# EasyEDA schematic SCH_stm32智能鱼缸v6_2024-12-07.json
TITLE: Sheet_1; REV: 1.0; Date: 2024-01-09; Sheet: 1/1; Drawn By: LightningFlash; Company: Your Company
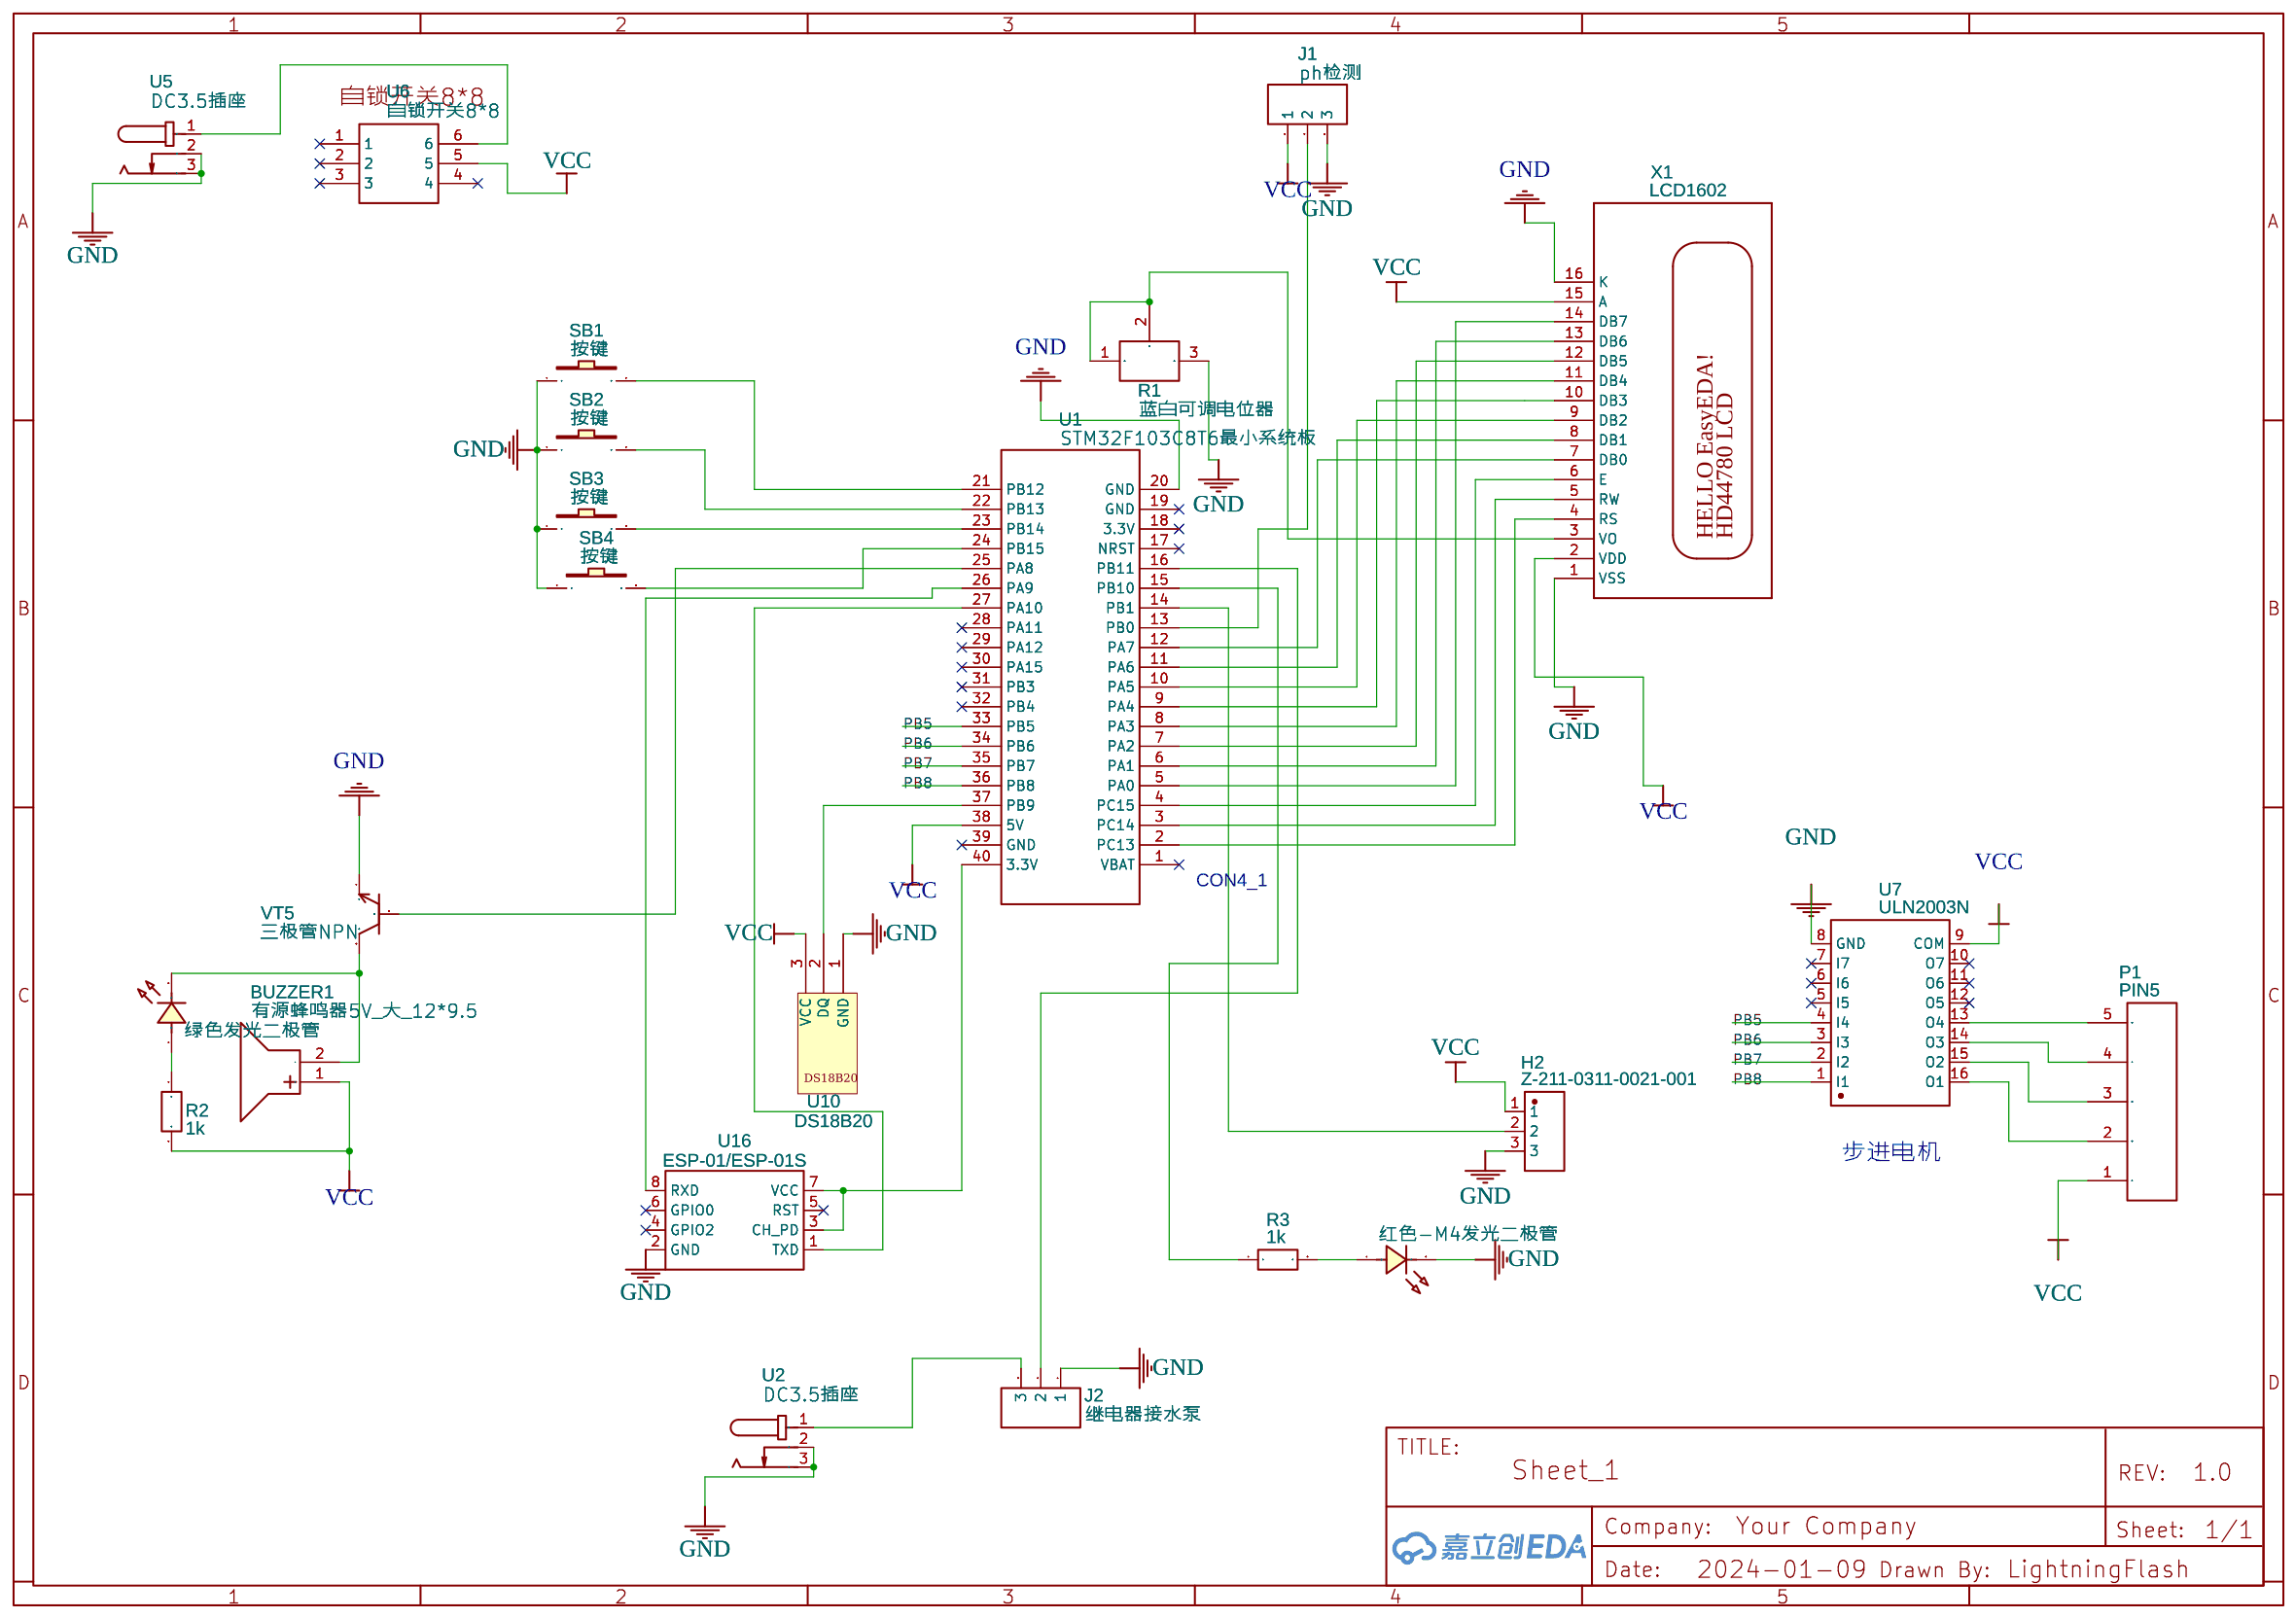
[diagram p0: schematic sheet]

## Parts
BUZZER1  有源蜂鸣器5V_大_12*9.5  [BUZ-TH_BD12.0-P7.60-D0.6-FD]
H2  Z-211-0311-0021-001  [HDR-TH_3P-P2.54-V-M-1]
J1  ph检测  [HDR-M-2.54_1X3]
J2  继电器接水泵  [HDR-M-2.54_1X3]
NO2  绿色发光二极管  [LED-TH_BD5.8-P2.50-R-RD_RED]
NO3  红色-M4发光二极管  [LED-TH_BD5.8-P2.50-R-RD_RED]
P1  PIN5  [PIN5]
R1  蓝白可调电位器  [RP-蓝白电位器]
R2  1k  [RESISTOR 1/4W SMALLER RESIZE]
R3  1k  [RESISTOR 1/4W SMALLER RESIZE]
SB1  按键  [按键]
SB2  按键  [按键]
SB3  按键  [按键]
SB4  按键  [按键]
U1  STM32F103C8T6最小系统板  [STM32F103C8T6最小模块]
U2  DC3.5插座  [DC插座3.5MM]
U5  DC3.5插座  [DC插座3.5MM]
U6  自锁开关8*8  [自锁开关8*8]
U7  ULN2003N  [DIP-16_L19.8-W6.5-P2.54-LS7.6-BL]
U10  DS18B20  [DS18B20]
U16  ESP-01/ESP-01S  [WIFI模块8266]
VT5  三极管NPN  [三极管NPN]
X1  LCD1602  [LCD1602]

## Library data of the parts
BUZZER1 = 有源蜂鸣器5V_大_12*9.5: Supplier: LCSC; Supplier Part: C194537; Manufacturer: ZLFY; Manufacturer Part: ZL-DCY12095-2305P-7.6; Contributor: LCSC
H2 = Z-211-0311-0021-001: Supplier: LCSC; Manufacturer: ZHENGLING; Contributor: LCSC; Supplier Part: C152153; JLCPCB Part Class: Extended Part
J1 J2 = HDR-M-2.54_1x3: Supplier Part: C180248; Supplier: LCSC; Contributor: LCEDA_Lib
NO2 NO3 = 红色-M4发光二极管: Supplier: LCSC; Supplier Part: C9900003231; Contributor: LCSC; JLCPCB Part Class: Extended Part
P1 = PIN5: Contributor: Alvin_li
R1 = 蓝白可调电位器: Contributor: jjc97
R2 R3 = R_0603_EU: Contributor: LCEDA_Lib; Package Display: No
SB1-SB4 = 按键: Contributor: garyqin
U1 = STM32F103C8T6最小系统板: Contributor: wjc112
U2 U5 = DC3.5插座: Supplier: UPZZZSTUDIO; Contributor: locolyl
U6 = 自锁开关8*8: Contributor: zry_972195923
U7 = ULN2003N: Supplier: LCSC; Supplier Part: C383065; Manufacturer: HGSEMI; Contributor: LCSC; JLCPCB Part Class: Extended Part
U10 = DS18B20: Contributor: Alisabeth
U16 = ESP-01/ESP-01S: Contributor: King3
VT5 = 三极管NPN: Contributor: WJCX
X1 = LCD1602: sourceId: Ukd7pHZTb

## Nets
GND: H2.3 J1.3 J2.1 NO3.2(K) R1.3 SB1.1 SB2.1 SB3.1 SB4.1 U1.20(GND) U2.2 U2.3 U5.2 U5.3 U7.8(GND) U10.1(GND) U16.2(GND) VT5.1 X1.1(VSS) X1.16(K)
VCC: BUZZER1.1(+) H2.1 J1.1 P1.1 R2.2 U1.38(5V) U6.5 U7.9(COM) U10.3(VCC) X1.2(VDD) X1.15(A)
PB5: U1.33(PB5) U7.4(I4)
PB6: U1.34(PB6) U7.3(I3)
PB7: U1.35(PB7) U7.2(I2)
PB8: U1.36(PB8) U7.1(I1)
Net-(BUZZER1-2): BUZZER1.2(-) NO2.2(K) VT5.3
Net-(H2-2): H2.2 U1.14(PB1)
Net-(J1-2): J1.2 U1.13(PB0)
Net-(J2-2): J2.2 U1.16(PB11)
Net-(J2-3): J2.3 U2.1
Net-(NO2-1): NO2.1(A) R2.1
Net-(NO3-1): NO3.1(A) R3.2
Net-(P1-2): P1.2 U7.16(O1)
Net-(P1-3): P1.3 U7.15(O2)
Net-(P1-4): P1.4 U7.14(O3)
Net-(P1-5): P1.5 U7.13(O4)
Net-(R1-1): R1.1(2) R1.2(1) X1.3(VO)
Net-(R3-1): R3.1 U1.15(PB10)
Net-(SB1-2): SB1.2 U1.21(PB12)
Net-(SB2-2): SB2.2 U1.22(PB13)
Net-(SB3-2): SB3.2 U1.23(PB14)
Net-(SB4-2): SB4.2 U1.24(PB15)
Net-(U1-2): U1.2(PC13) X1.4(RS)
Net-(U1-3): U1.3(PC14) X1.5(RW)
Net-(U1-4): U1.4(PC15) X1.6(E)
Net-(U1-5): U1.5(PA0) X1.14(DB7)
Net-(U1-6): U1.6(PA1) X1.13(DB6)
Net-(U1-7): U1.7(PA2) X1.12(DB5)
Net-(U1-8): U1.8(PA3) X1.11(DB4)
Net-(U1-9): U1.9(PA4) X1.10(DB3)
Net-(U1-10): U1.10(PA5) X1.9(DB2)
Net-(U1-11): U1.11(PA6) X1.8(DB1)
Net-(U1-12): U1.12(PA7) X1.7(DB0)
Net-(U1-25): U1.25(PA8) VT5.2
Net-(U1-26): U1.26(PA9) U16.8(RXD)
Net-(U1-27): U1.27(PA10) U16.1(TXD)
Net-(U1-37): U1.37(PB9) U10.2(DQ)
Net-(U1-40): U1.40(3.3V) U16.3(CH_PD) U16.7(VCC)
Net-(U5-1): U5.1 U6.6

Not connected (* = marked no-connect by the designer): U1 1(VBAT)* 17(NRST)* 18(3.3V)* 19(GND)* 28(PA11)* 29(PA12)* 30(PA15)* 31(PB3)* 32(PB4)* 39(GND)*; U6 1* 2* 3* 4*; U7 5(I5)* 6(I6)* 7(I7)* 10(O7)* 11(O6)* 12(O5)*; U16 4(GPIO2)* 5(RST)* 6(GPIO0)*

## Notes on the sheet
- CON4_1
- 步进电机
